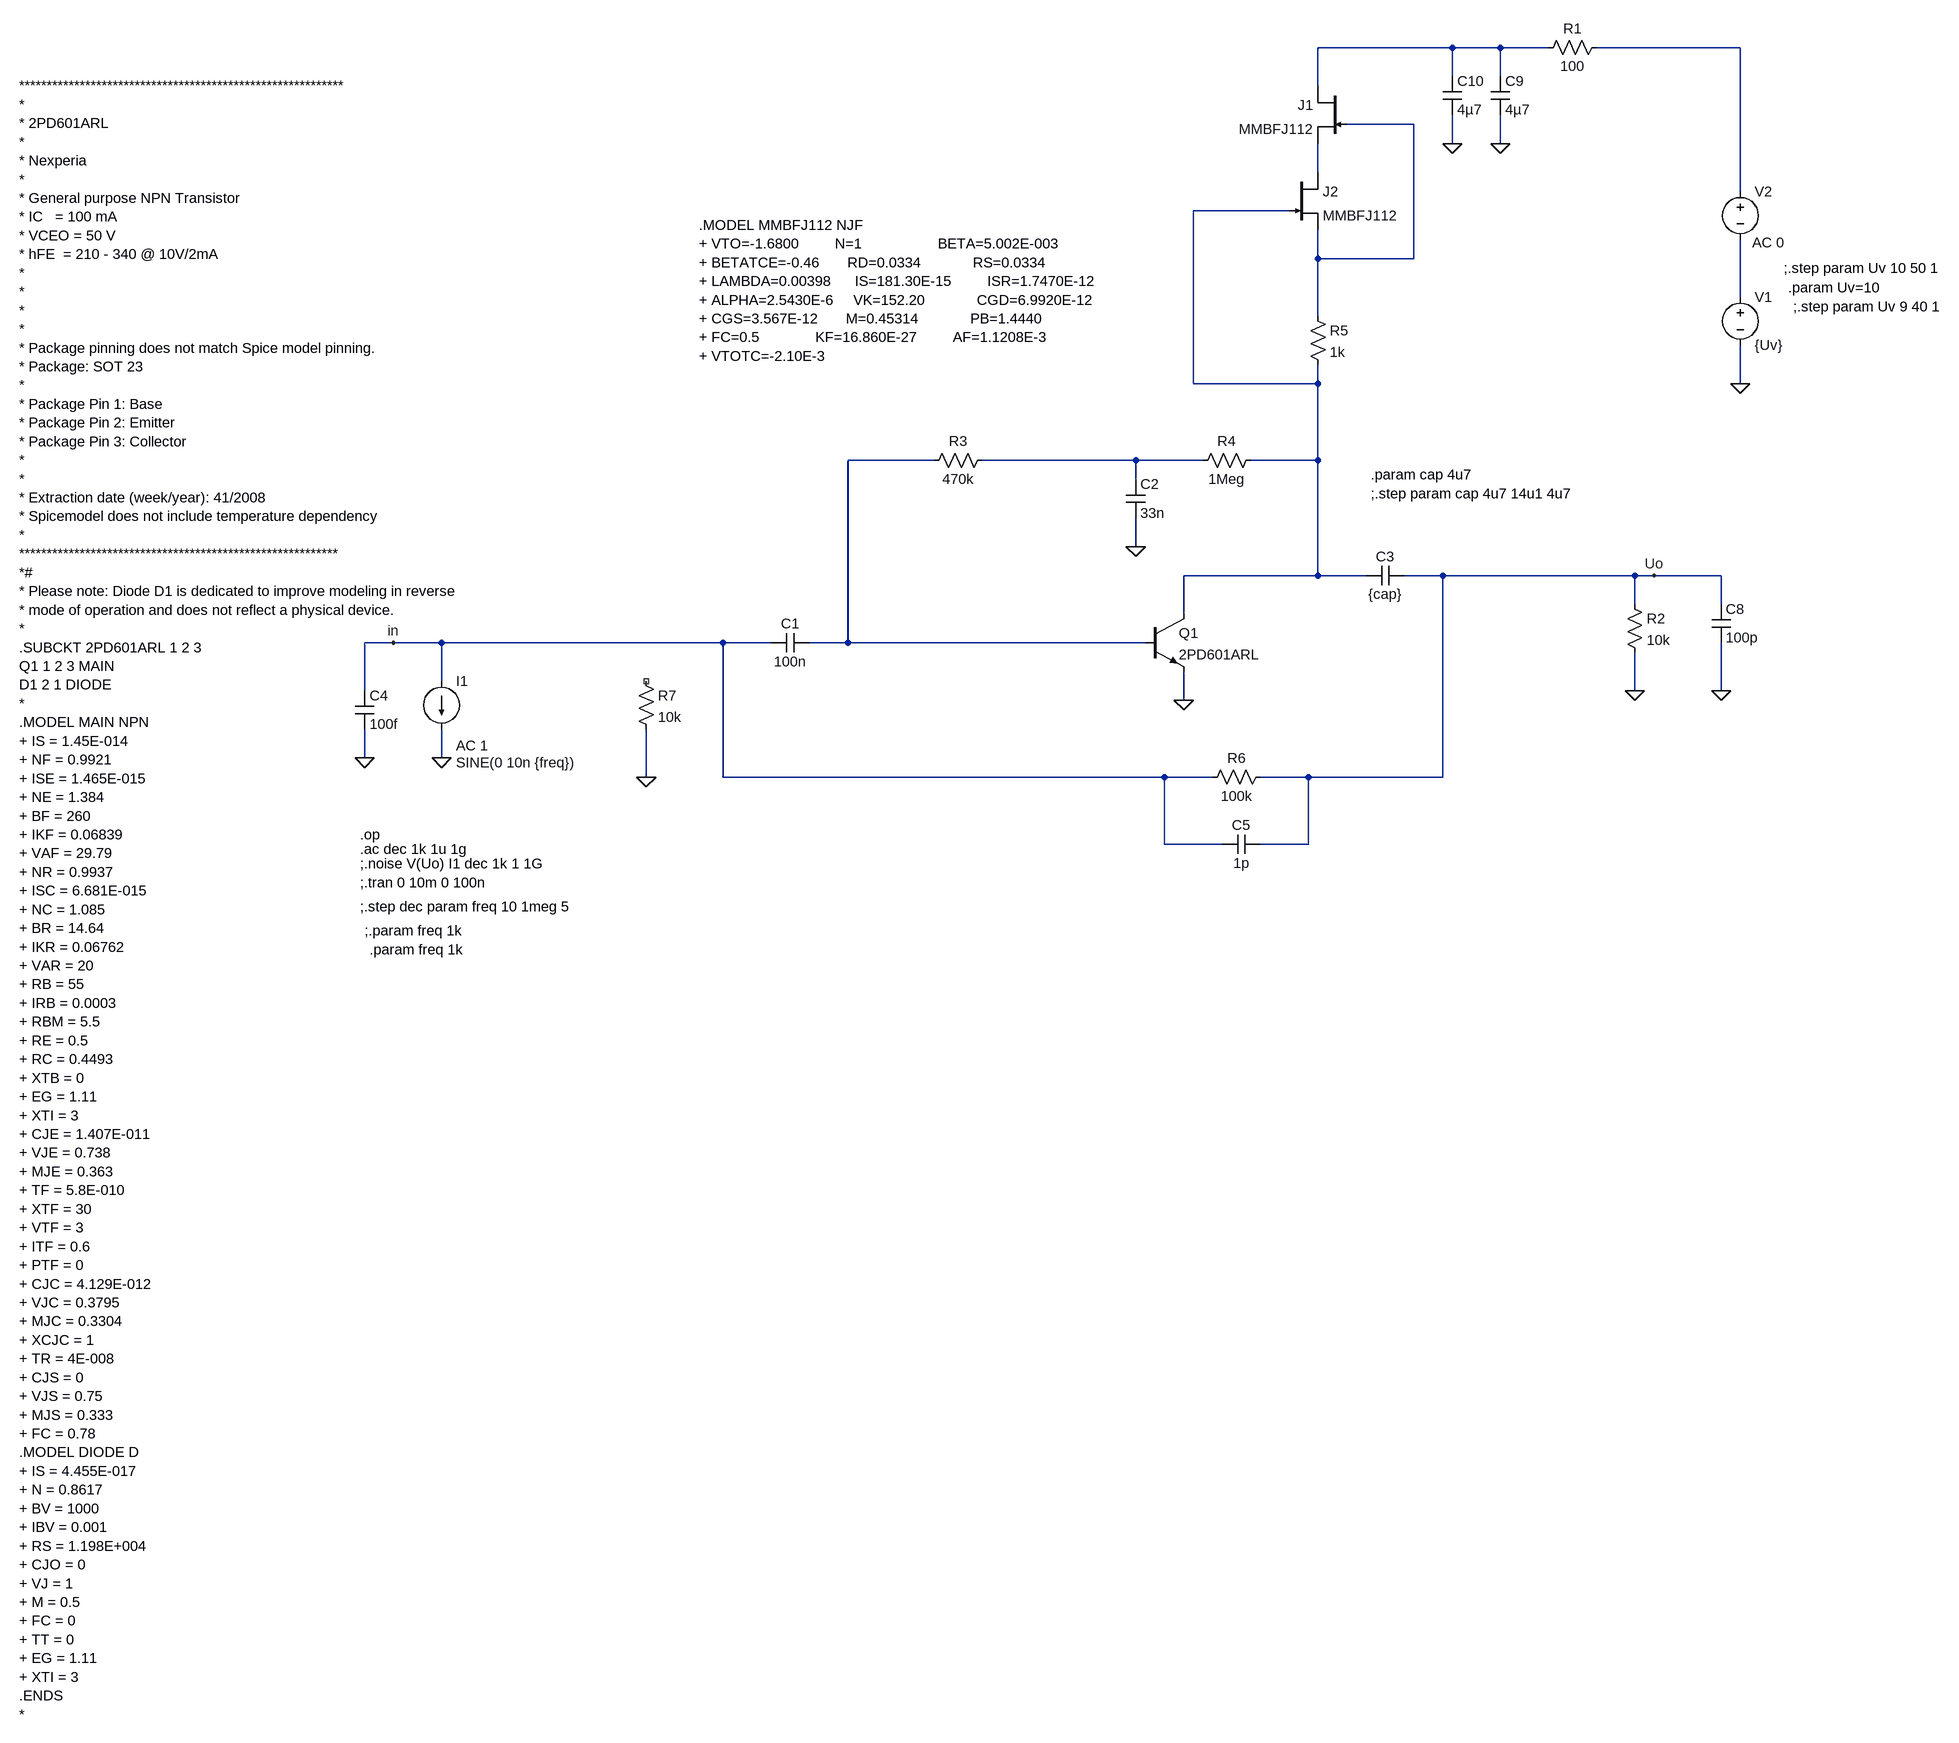
[diagram p0: schematic v2.0.asc]
v2.0.asc, the LTspice schematic file:
Version 4
SHEET 1 1828 2076
WIRE 848 -816 624 -816
WIRE 928 -816 848 -816
WIRE 1008 -816 928 -816
WIRE 1328 -816 1088 -816
WIRE 848 -768 848 -816
WIRE 928 -768 928 -816
WIRE 624 -752 624 -816
WIRE 784 -688 672 -688
WIRE 848 -656 848 -704
WIRE 928 -656 928 -704
WIRE 624 -608 624 -656
WIRE 1328 -576 1328 -816
WIRE 576 -544 416 -544
WIRE 624 -464 624 -512
WIRE 784 -464 784 -688
WIRE 784 -464 624 -464
WIRE 1328 -400 1328 -496
WIRE 624 -368 624 -464
WIRE 416 -256 416 -544
WIRE 624 -256 624 -288
WIRE 624 -256 416 -256
WIRE 1328 -256 1328 -320
WIRE -16 -128 -160 -128
WIRE 320 -128 64 -128
WIRE 432 -128 320 -128
WIRE 624 -128 624 -256
WIRE 624 -128 512 -128
WIRE 320 -96 320 -128
WIRE 320 16 320 -32
WIRE 624 64 624 -128
WIRE 624 64 400 64
WIRE 704 64 624 64
WIRE 832 64 768 64
WIRE 1152 64 832 64
WIRE 1184 64 1152 64
WIRE 1296 64 1184 64
WIRE 1152 112 1152 64
WIRE 1296 112 1296 64
WIRE 400 128 400 64
WIRE -1104 176 -1152 176
WIRE -1024 176 -1104 176
WIRE -368 176 -1024 176
WIRE -288 176 -368 176
WIRE -160 176 -160 -128
WIRE -160 176 -224 176
WIRE 336 176 -160 176
WIRE -1024 240 -1024 176
WIRE -1152 256 -1152 176
WIRE 1152 256 1152 192
WIRE 1296 256 1296 176
WIRE 400 272 400 224
WIRE -1152 368 -1152 320
WIRE -1024 368 -1024 320
WIRE -496 400 -496 320
WIRE -368 400 -368 176
WIRE 368 400 -368 400
WIRE 448 400 368 400
WIRE 608 400 528 400
WIRE 832 400 832 64
WIRE 832 400 608 400
WIRE 368 512 368 400
WIRE 464 512 368 512
WIRE 608 512 608 400
WIRE 608 512 528 512
FLAG 400 272 0
FLAG 1152 256 0
FLAG 1184 64 Uo
FLAG 320 16 0
FLAG 1328 -256 0
FLAG -1024 368 0
FLAG -1152 368 0
FLAG 1296 256 0
FLAG 848 -656 0
FLAG 928 -656 0
FLAG -1104 176 in
FLAG -496 400 0
DATAFLAG 224 176 ""
DATAFLAG 480 64 ""
DATAFLAG 912 64 ""
DATAFLAG 704 -816 "$-V(N003)"
DATAFLAG 480 -544 "$-V(N003)"
SYMBOL res 1136 96 R0
SYMATTR InstName R2
SYMATTR Value 10k
SYMBOL cap -224 160 R90
WINDOW 0 0 32 VBottom 2
WINDOW 3 32 32 VTop 2
SYMATTR InstName C1
SYMATTR Value 100n
SYMBOL res 80 -144 R90
WINDOW 0 0 56 VBottom 2
WINDOW 3 32 56 VTop 2
SYMATTR InstName R3
SYMATTR Value 470k
SYMBOL res 528 -144 R90
WINDOW 0 0 56 VBottom 2
WINDOW 3 32 56 VTop 2
SYMATTR InstName R4
SYMATTR Value 1Meg
SYMBOL cap 304 -96 R0
SYMATTR InstName C2
SYMATTR Value 33n
SYMBOL cap 768 48 R90
WINDOW 0 0 32 VBottom 2
WINDOW 3 32 32 VTop 2
SYMATTR InstName C3
SYMATTR Value {cap}
SYMBOL njf 672 -752 M0
SYMATTR InstName J1
SYMATTR Value MMBFJ112
SYMBOL res 608 -384 R0
SYMATTR InstName R5
SYMATTR Value 1k
SYMBOL voltage 1328 -416 R0
WINDOW 123 0 0 Left 0
WINDOW 39 0 0 Left 0
SYMATTR InstName V1
SYMATTR Value {Uv}
SYMBOL current -1024 240 R0
WINDOW 3 24 136 Left 2
WINDOW 123 24 108 Left 2
WINDOW 39 0 0 Left 0
SYMATTR Value SINE(0 10n {freq})
SYMATTR Value2 AC 1
SYMATTR InstName I1
SYMBOL cap -1168 256 R0
SYMATTR InstName C4
SYMATTR Value 100f
SYMBOL res 544 384 R90
WINDOW 0 0 56 VBottom 2
WINDOW 3 32 56 VTop 2
SYMATTR InstName R6
SYMATTR Value 100k
SYMBOL cap 1280 112 R0
SYMATTR InstName C8
SYMATTR Value 100p
SYMBOL res 1104 -832 R90
WINDOW 0 0 56 VBottom 2
WINDOW 3 32 56 VTop 2
SYMATTR InstName R1
SYMATTR Value 100
SYMBOL cap 912 -768 R0
SYMATTR InstName C9
SYMATTR Value 4µ7
SYMBOL cap 832 -768 R0
SYMATTR InstName C10
SYMATTR Value 4µ7
SYMBOL voltage 1328 -592 R0
WINDOW 3 24 96 Invisible 2
WINDOW 123 20 101 Left 2
WINDOW 39 0 0 Left 0
SYMATTR Value 0
SYMATTR Value2 AC 0
SYMATTR InstName V2
SYMBOL njf 576 -608 R0
SYMATTR InstName J2
SYMATTR Value MMBFJ112
SYMBOL npn 336 128 R0
SYMATTR InstName Q1
SYMATTR Value 2PD601ARL
SYMATTR Prefix X
SYMBOL cap 528 496 R90
WINDOW 0 0 32 VBottom 2
WINDOW 3 32 32 VTop 2
SYMATTR InstName C5
SYMATTR Value 1p
SYMBOL res -512 224 R0
SYMATTR InstName R7
SYMATTR Value 10k
TEXT -1160 496 Left 2 !.op
TEXT -1160 520 Left 2 !.ac dec 1k 1u 1g
TEXT 1400 -448 Left 2 !;.step param Uv 10 50 1
TEXT 1408 -416 Left 2 !.param Uv=10
TEXT -1160 544 Left 2 !;.noise V(Uo) I1 dec 1k 1 1G
TEXT -408 -520 Left 2 !.MODEL MMBFJ112 NJF\n+ VTO=-1.6800         N=1                   BETA=5.002E-003\n+ BETATCE=-0.46       RD=0.0334             RS=0.0334                  \n+ LAMBDA=0.00398      IS=181.30E-15         ISR=1.7470E-12\n+ ALPHA=2.5430E-6     VK=152.20             CGD=6.9920E-12          \n+ CGS=3.567E-12       M=0.45314             PB=1.4440  \n+ FC=0.5              KF=16.860E-27         AF=1.1208E-3        \n+ VTOTC=-2.10E-3
TEXT -1728 -752 Left 2 !***********************************************************\n*\n* 2PD601ARL\n*\n* Nexperia\n*\n* General purpose NPN Transistor\n* IC   = 100 mA\n* VCEO = 50 V \n* hFE  = 210 - 340 @ 10V/2mA\n*\n*\n*\n*\n* Package pinning does not match Spice model pinning.\n* Package: SOT 23\n* \n* Package Pin 1: Base\n* Package Pin 2: Emitter\n* Package Pin 3: Collector\n*\n*\n* Extraction date (week/year): 41/2008  \n* Spicemodel does not include temperature dependency\n*\n**********************************************************\n*#\n* Please note: Diode D1 is dedicated to improve modeling in reverse\n* mode of operation and does not reflect a physical device.\n*\n.SUBCKT 2PD601ARL 1 2 3\nQ1 1 2 3 MAIN\nD1 2 1 DIODE\n*\n.MODEL MAIN NPN \n+ IS = 1.45E-014 \n+ NF = 0.9921 \n+ ISE = 1.465E-015 \n+ NE = 1.384 \n+ BF = 260 \n+ IKF = 0.06839 \n+ VAF = 29.79 \n+ NR = 0.9937 \n+ ISC = 6.681E-015 \n+ NC = 1.085 \n+ BR = 14.64 \n+ IKR = 0.06762 \n+ VAR = 20 \n+ RB = 55 \n+ IRB = 0.0003 \n+ RBM = 5.5 \n+ RE = 0.5 \n+ RC = 0.4493 \n+ XTB = 0 \n+ EG = 1.11 \n+ XTI = 3 \n+ CJE = 1.407E-011 \n+ VJE = 0.738 \n+ MJE = 0.363 \n+ TF = 5.8E-010 \n+ XTF = 30 \n+ VTF = 3 \n+ ITF = 0.6 \n+ PTF = 0 \n+ CJC = 4.129E-012 \n+ VJC = 0.3795 \n+ MJC = 0.3304 \n+ XCJC = 1 \n+ TR = 4E-008 \n+ CJS = 0 \n+ VJS = 0.75 \n+ MJS = 0.333 \n+ FC = 0.78 \n.MODEL DIODE D \n+ IS = 4.455E-017 \n+ N = 0.8617 \n+ BV = 1000 \n+ IBV = 0.001 \n+ RS = 1.198E+004 \n+ CJO = 0 \n+ VJ = 1 \n+ M = 0.5 \n+ FC = 0 \n+ TT = 0 \n+ EG = 1.11 \n+ XTI = 3 \n.ENDS\n*
TEXT -1160 576 Left 2 !;.tran 0 10m 0 100n
TEXT -1160 616 Left 2 !;.step dec param freq 10 1meg 5
TEXT -1152 656 Left 2 !;.param freq 1k
TEXT 712 -72 Left 2 !;.step param cap 4u7 14u1 4u7
TEXT -1144 688 Left 2 !.param freq 1k
TEXT 712 -104 Left 2 !.param cap 4u7
TEXT 1416 -384 Left 2 !;.step param Uv 9 40 1

The netlist it stands for:
* v2.0.asc
R2 Uo 0 10k
C1 N007 in 100n
R3 N008 N007 470k
R4 N005 N008 1Meg
C2 N008 0 33n
C3 Uo N005 {cap}
J1 N001 N003 N004 MMBFJ112
R5 N003 N005 1k
V1 N006 0 {Uv}
I1 in 0 SINE(0 10n {freq}) AC 1
C4 in 0 100f
R6 Uo in 100k
C8 Uo 0 100p
R1 N002 N001 100
C9 N001 0 4µ7
C10 N001 0 4µ7
V2 N002 N006 0 AC 0
J2 N004 N005 N003 MMBFJ112
XQ1 N005 N007 0 2PD601ARL  ; pins C B E
C5 Uo in 1p
R7 NC_01 0 10k
.model NJF NJF
.model PJF PJF
.lib standard.jft
.op
.ac dec 1k 1u 1g
;.step param Uv 10 50 1
.param Uv=10
;.noise V(Uo) I1 dec 1k 1 1G
.MODEL MMBFJ112 NJF
+ VTO=-1.6800         N=1                   BETA=5.002E-003
+ BETATCE=-0.46       RD=0.0334             RS=0.0334
+ LAMBDA=0.00398      IS=181.30E-15         ISR=1.7470E-12
+ ALPHA=2.5430E-6     VK=152.20             CGD=6.9920E-12
+ CGS=3.567E-12       M=0.45314             PB=1.4440
+ FC=0.5              KF=16.860E-27         AF=1.1208E-3
+ VTOTC=-2.10E-3
***********************************************************
*
* 2PD601ARL
*
* Nexperia
*
* General purpose NPN Transistor
* IC   = 100 mA
* VCEO = 50 V
* hFE  = 210 - 340 @ 10V/2mA
*
*
*
*
* Package pinning does not match Spice model pinning.
* Package: SOT 23
*
* Package Pin 1: Base
* Package Pin 2: Emitter
* Package Pin 3: Collector
*
*
* Extraction date (week/year): 41/2008
* Spicemodel does not include temperature dependency
*
**********************************************************
*#
* Please note: Diode D1 is dedicated to improve modeling in reverse
* mode of operation and does not reflect a physical device.
*
.SUBCKT 2PD601ARL 1 2 3
Q1 1 2 3 MAIN
D1 2 1 DIODE
*
.MODEL MAIN NPN
+ IS = 1.45E-014
+ NF = 0.9921
+ ISE = 1.465E-015
+ NE = 1.384
+ BF = 260
+ IKF = 0.06839
+ VAF = 29.79
+ NR = 0.9937
+ ISC = 6.681E-015
+ NC = 1.085
+ BR = 14.64
+ IKR = 0.06762
+ VAR = 20
+ RB = 55
+ IRB = 0.0003
+ RBM = 5.5
+ RE = 0.5
+ RC = 0.4493
+ XTB = 0
+ EG = 1.11
+ XTI = 3
+ CJE = 1.407E-011
+ VJE = 0.738
+ MJE = 0.363
+ TF = 5.8E-010
+ XTF = 30
+ VTF = 3
+ ITF = 0.6
+ PTF = 0
+ CJC = 4.129E-012
+ VJC = 0.3795
+ MJC = 0.3304
+ XCJC = 1
+ TR = 4E-008
+ CJS = 0
+ VJS = 0.75
+ MJS = 0.333
+ FC = 0.78
.MODEL DIODE D
+ IS = 4.455E-017
+ N = 0.8617
+ BV = 1000
+ IBV = 0.001
+ RS = 1.198E+004
+ CJO = 0
+ VJ = 1
+ M = 0.5
+ FC = 0
+ TT = 0
+ EG = 1.11
+ XTI = 3
.ENDS
*
;.tran 0 10m 0 100n
;.step dec param freq 10 1meg 5
;.param freq 1k
;.step param cap 4u7 14u1 4u7
.param freq 1k
.param cap 4u7
;.step param Uv 9 40 1
.backanno
.end